# EAGLE schematic SparkFun_Auto_pHAT (EAGLE 9.5.2)

## Sheet 1 of 3
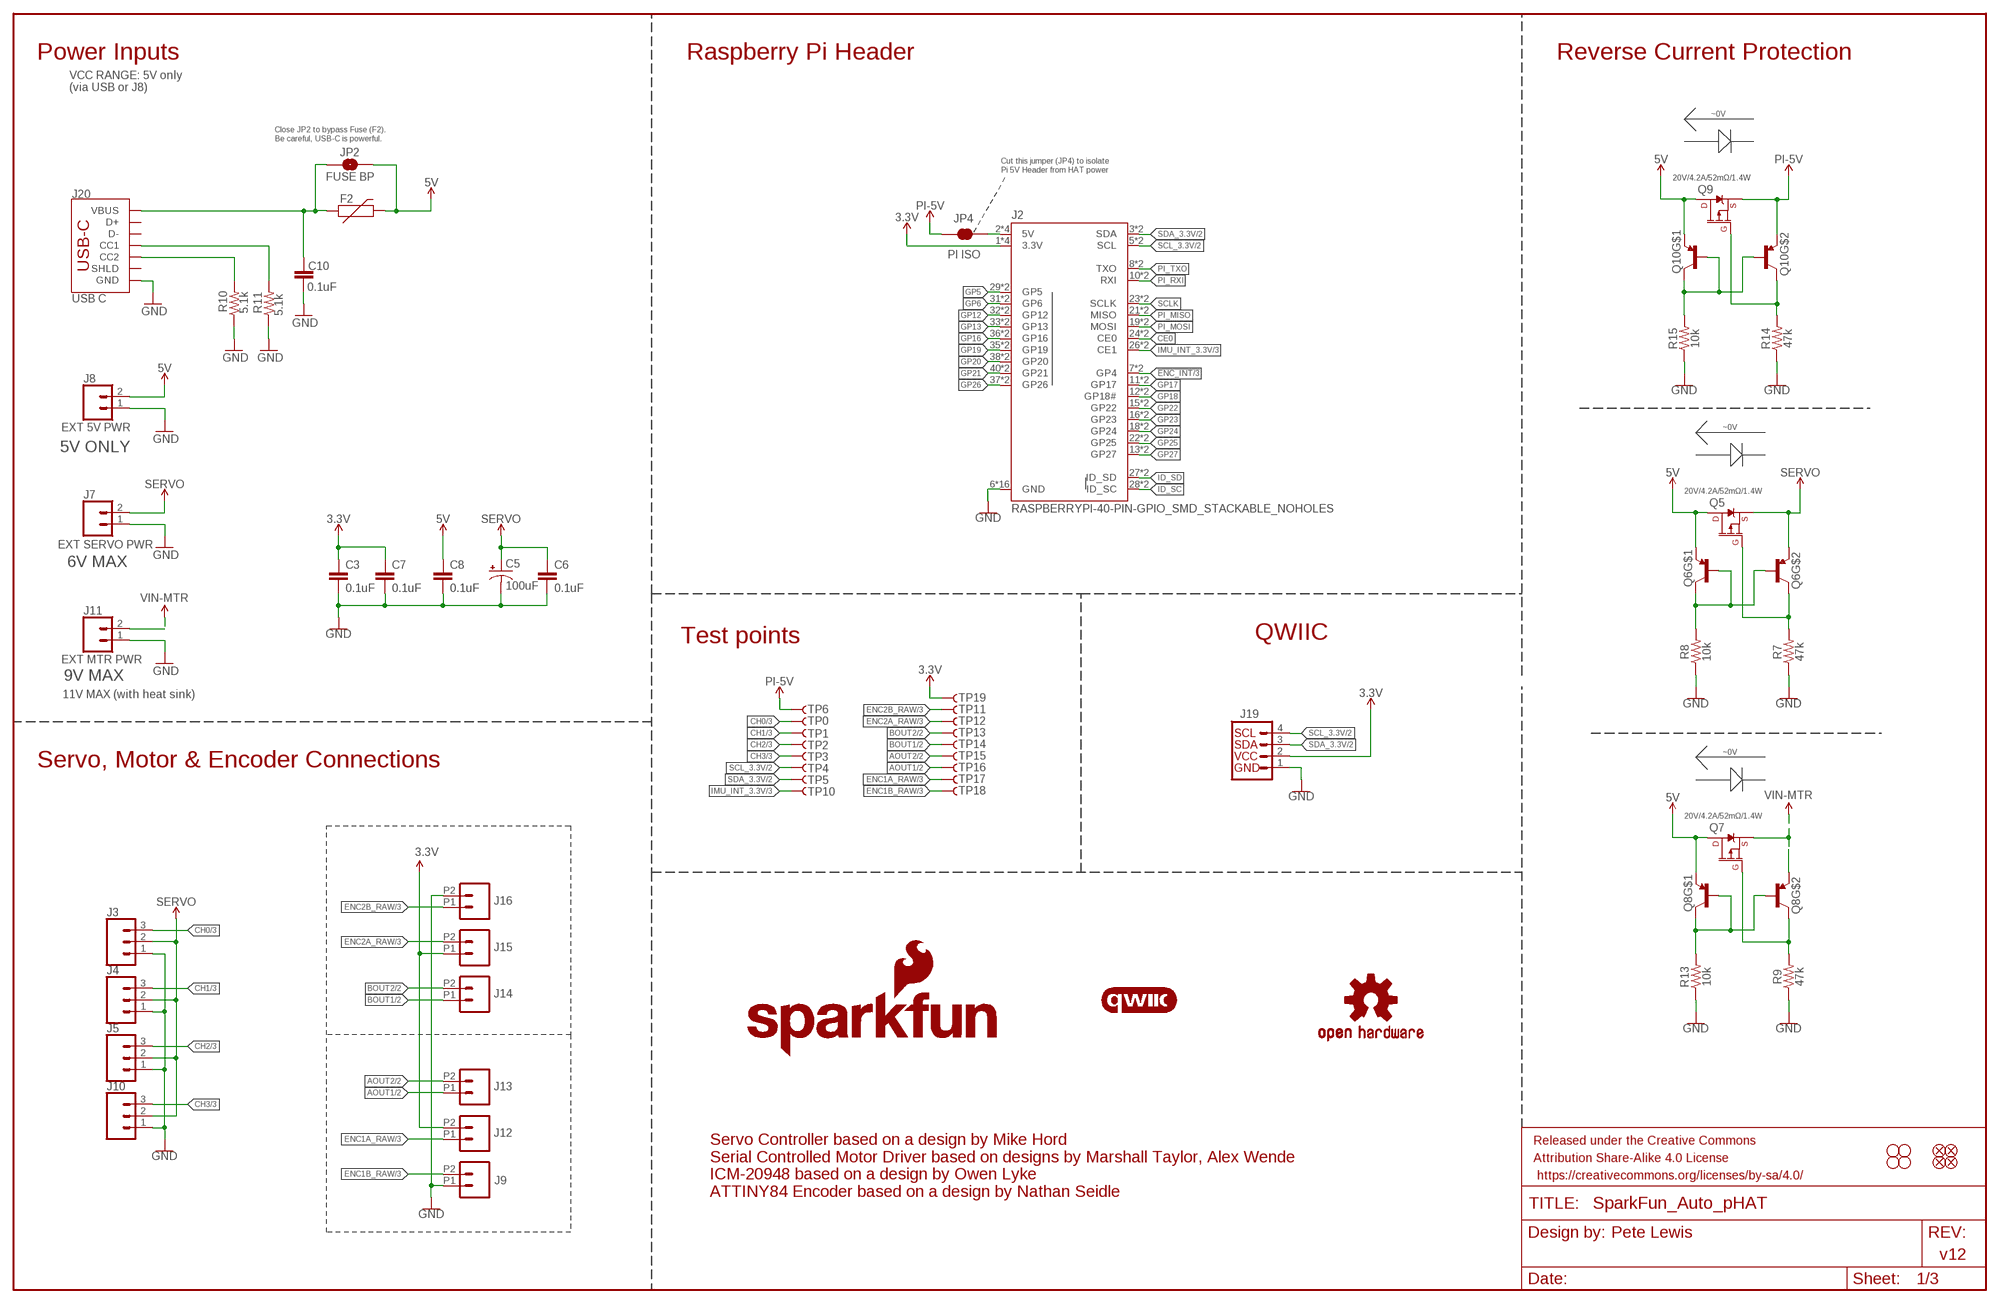
[diagram p0: schematic, sheet 1]

### Parts
C3  0.1uF  0.1UF-0603-25V-(+80/-20%)  [0603]
C5  100uF  100UF-POLAR-25V-20%(ELEC)  [PANASONIC_D]
C6  0.1uF  0.1UF-0603-25V-(+80/-20%)  [0603]
C7  0.1uF  0.1UF-0603-25V-(+80/-20%)  [0603]
C8  0.1uF  0.1UF-0603-25V-(+80/-20%)  [0603]
C10  0.1uF  0.1UF-0603-25V-(+80/-20%)  [0603]
F2  16V/2.5A(5A TRIP)  PPTC_16V_2.5A  [1812]
FD5  FIDUCIALUFIDUCIAL  [FIDUCIAL-MICRO]
FD6  FIDUCIALUFIDUCIAL  [FIDUCIAL-MICRO]
FD7  FIDUCIALUFIDUCIAL  [FIDUCIAL-MICRO]
FD8  FIDUCIALUFIDUCIAL  [FIDUCIAL-MICRO]
FRAME2  FRAME-LEDGER  [CREATIVE_COMMONS]
H9  STAND-OFFTIGHT  [STAND-OFF-TIGHT]
H10  STAND-OFFTIGHT  [STAND-OFF-TIGHT]
H11  STAND-OFFTIGHT  [STAND-OFF-TIGHT]
H12  STAND-OFFTIGHT  [STAND-OFF-TIGHT]
J2  RASPBERRYPI-40-PIN-GPIO_SMD_STACKABLE_NOHOLES  [RASPBERRY_PI_HAT_40_PIN_SMD_STACKABLE_NOHOLES]
J3  CONN_03LOCK  [1X03_LOCK]
J4  CONN_03LOCK  [1X03_LOCK]
J5  CONN_03LOCK  [1X03_LOCK]
J7  EXT SERVO PWR  CONN_02  [1X02]
J8  EXT 5V PWR  CONN_02  [1X02]
J9  CONN_02LG_DRILL  [1X02_2.54_SCREWTERM_LG_DRILL]
J10  CONN_03LOCK  [1X03_LOCK]
J11  EXT MTR PWR  CONN_02  [1X02]
J12  CONN_022.54MM_SCREWTERM  [1X02_2.54_SCREWTERM]
J13  CONN_02LG_DRILL  [1X02_2.54_SCREWTERM_LG_DRILL]
J14  CONN_02LG_DRILL  [1X02_2.54_SCREWTERM_LG_DRILL]
J15  CONN_022.54MM_SCREWTERM  [1X02_2.54_SCREWTERM]
J16  CONN_02LG_DRILL  [1X02_2.54_SCREWTERM_LG_DRILL]
J19  QWIIC_CONNECTORJS-1MM  [JST04_1MM_RA]
J20  USB C  USB_C2-LAYER  [USB-C-16P]
JP2  FUSE BP  JUMPER-SMT_2_NO_SILK  [SMT-JUMPER_2_NO_SILK]
JP4  PI ISO  JUMPER-SMT_2_NC_TRACE_SILK  [SMT-JUMPER_2_NC_TRACE_SILK]
LOGO1  SFE_LOGO_NAME_FLAME.1_INCH  [SFE_LOGO_NAME_FLAME_.1]
LOGO2  OSHW-LOGOS  [OSHW-LOGO-S]
Q5  20V/4.2A/52mΩ/1.4W  MOSFET_PCH-DMG2305UX-7  [SOT23-3]
Q6  TRANS_PNP_DUALSOT-363  [SOT363_PHILIPS]
Q7  20V/4.2A/52mΩ/1.4W  MOSFET_PCH-DMG2305UX-7  [SOT23-3]
Q8  TRANS_PNP_DUALSOT-363  [SOT363_PHILIPS]
Q9  20V/4.2A/52mΩ/1.4W  MOSFET_PCH-DMG2305UX-7  [SOT23-3]
Q10  TRANS_PNP_DUALSOT-363  [SOT363_PHILIPS]
R7  47k  47KOHM-0603-1/10W-1%  [0603@1]
R8  10k  10KOHM-0603-1/10W-1%  [0603@1]
R9  47k  47KOHM-0603-1/10W-1%  [0603@1]
R10  5.1k  5.1KOHM5.1KOHM-0603-1/10W-1%  [0603@1]
R11  5.1k  5.1KOHM5.1KOHM-0603-1/10W-1%  [0603@1]
R13  10k  10KOHM-0603-1/10W-1%  [0603@1]
R14  47k  47KOHM-0603-1/10W-1%  [0603@1]
R15  10k  10KOHM-0603-1/10W-1%  [0603@1]
TP0  TEST-POINT3X4  [PAD.03X.04]
TP1  TEST-POINT3X4  [PAD.03X.04]
TP2  TEST-POINT3X4  [PAD.03X.04]
TP3  TEST-POINT3X4  [PAD.03X.04]
TP4  TEST-POINTTP_15TH_THRU  [TP_15TH]
TP5  TEST-POINTTP_15TH_THRU  [TP_15TH]
TP6  TEST-POINT3X4  [PAD.03X.04]
TP10  TEST-POINT3X4  [PAD.03X.04]
TP11  TEST-POINT3X4  [PAD.03X.04]
TP12  TEST-POINT3X4  [PAD.03X.04]
TP13  TEST-POINT3X4  [PAD.03X.04]
TP14  TEST-POINT3X4  [PAD.03X.04]
TP15  TEST-POINT3X4  [PAD.03X.04]
TP16  TEST-POINT3X4  [PAD.03X.04]
TP17  TEST-POINT3X4  [PAD.03X.04]
TP18  TEST-POINT3X4  [PAD.03X.04]
TP19  TEST-POINTTP_15TH_THRU  [TP_15TH]
U$1  QWIIC_LOGO_5MM  [QWIIC_5MM]

### Nets
3.3V: C3.1 C7.1 J2.1(3.3V) J2.1B(3.3V) J2.17(3.3V) J2.17B(3.3V) J12.P2 J15.P1 J19.2 TP19.P$1 ; also sheet 2,3
5V: C8.1 F2.2 J8.2 JP2.2 Q5.3(D) Q6.1(E) Q7.3(D) Q8.1(E) Q9.3(D) Q10.1(E) ; also sheet 3
!ENC_INT: J2.7(GP4) J2.7B(GP4) ; also sheet 3
AOUT1: J13.P1 TP16.P$1 ; also sheet 2
AOUT2: J13.P2 TP15.P$1 ; also sheet 2
BOUT1: J14.P1 TP14.P$1 ; also sheet 2
BOUT2: J14.P2 TP13.P$1 ; also sheet 2
CC1: J20.A5(CC1) R11.2
CC2: J20.B5(CC2) R10.2
CE0: J2.24(CE0) J2.24B(CE0)
CH0: J3.3 TP0.P$1 ; also sheet 3
CH1: J4.3 TP1.P$1 ; also sheet 3
CH2: J5.3 TP2.P$1 ; also sheet 3
CH3: J10.3 TP3.P$1 ; also sheet 3
ENC1A_RAW: J12.P1 TP17.P$1 ; also sheet 3
ENC1B_RAW: J9.P2 TP18.P$1 ; also sheet 3
ENC2A_RAW: J15.P2 TP12.P$1 ; also sheet 3
ENC2B_RAW: J16.P1 TP11.P$1 ; also sheet 3
GND: C3.2 C5.- C6.2 C7.2 C8.2 C10.2 J2.6(GND) J2.6B(GND) J2.9(GND) J2.9B(GND) J2.14(GND) J2.14B(GND) J2.20(GND) J2.20B(GND) J2.25(GND) J2.25B(GND) J2.30(GND) J2.30B(GND) J2.34(GND) J2.34B(GND) J2.39(GND) J2.39B(GND) J3.1 J4.1 J5.1 J7.1 J8.1 J9.P1 J10.1 J11.1 J16.P2 J19.1 J20.GND J20.GND2(GND) R7.1 R8.1 R9.1 R10.1 R11.1 R13.1 R14.1 R15.1 ; also sheet 2,3
GP5: J2.29(GP5) J2.29B(GP5)
GP6: J2.31(GP6) J2.31B(GP6)
GP12: J2.32(GP12) J2.32B(GP12)
GP13: J2.33(GP13) J2.33B(GP13)
GP16: J2.36(GP16) J2.36B(GP16)
GP17: J2.11(GP17) J2.11B(GP17)
GP18: J2.12(GP18#) J2.12B(GP18#)
GP19: J2.35(GP19) J2.35B(GP19)
GP20: J2.38(GP20) J2.38B(GP20)
GP21: J2.40(GP21) J2.40B(GP21)
GP22: J2.15(GP22) J2.15B(GP22)
GP23: J2.16(GP23) J2.16B(GP23)
GP24: J2.18(GP24) J2.18B(GP24)
GP25: J2.22(GP25) J2.22B(GP25)
GP26: J2.37(GP26) J2.37B(GP26)
GP27: J2.13(GP27) J2.13B(GP27)
ID_SC: J2.28(ID_SC) J2.28B(ID_SC)
ID_SD: J2.27(ID_SD) J2.27B(ID_SD)
IMU_INT_3.3V: J2.26(CE1) J2.26B(CE1) TP10.P$1 ; also sheet 3
N$1: Q5.1(G) Q6.3(C) R7.2
N$11: Q6.2(B) Q6.5(B) Q6.6(C) R8.2
N$15: Q7.1(G) Q8.3(C) R9.2
N$16: Q8.2(B) Q8.5(B) Q8.6(C) R13.2
N$18: Q9.1(G) Q10.3(C) R14.2
N$19: Q10.2(B) Q10.5(B) Q10.6(C) R15.2
N$20: J2.2(5V) J2.2B(5V) J2.4(5V) J2.4B(5V) JP4.2
PI-5V: JP4.1 Q9.2(S) Q10.4(E) TP6.P$1
PI_MISO: J2.21(MISO) J2.21B(MISO)
PI_MOSI: J2.19(MOSI) J2.19B(MOSI)
PI_RXI: J2.10(RXI) J2.10B(RXI)
PI_TXO: J2.8(TXO) J2.8B(TXO)
SCL_3.3V: J2.5(SCL) J2.5B(SCL) J19.4 TP4.P$1 ; also sheet 2,3
SCLK: J2.23(SCLK) J2.23B(SCLK)
SDA_3.3V: J2.3(SDA) J2.3B(SDA) J19.3 TP5.P$1 ; also sheet 2,3
SERVO: C5.+ C6.1 J3.2 J4.2 J5.2 J7.2 J10.2 Q5.2(S) Q6.4(E)
VBUS [power]: C10.1 F2.1 J20.VBUS1(VBUS) J20.VBUS2(VBUS) JP2.1
VIN-MTR: J11.2 Q7.2(S) Q8.4(E) ; also sheet 2
Unconnected: J20.A6(D+) J20.A7(D-) J20.B6(D+) J20.B7(D-) J20.SHLD1(SHLD) J20.SHLD2(SHLD) J20.SHLD3(SHLD) J20.SHLD4(SHLD) J20.SHLD5(SHLD) J20.SHLD6(SHLD) J20.SHLD7(SHLD) J20.SHLD8(SHLD)

### Notes on the sheet
- Power Inputs | Raspberry Pi Header | Reverse Current Protection
- VCC RANGE: 5V only
  (via USB or J8)
- ~0V
- Close JP2 to bypass Fuse (F2).
  Be careful, USB-C is powerful.
- Cut this jumper (JP4) to isolate
  Pi 5V Header from HAT power
- ~0V
- 5V ONLY
- 6V MAX
- Test points | QWIIC
- 9V MAX
- 11V MAX (with heat sink)
- ~0V
- Servo, Motor & Encoder Connections
- Servo Controller based on a design by Mike Hord
  Serial Controlled Motor Driver based on designs by Marshall Taylor, Alex Wende
  ICM-20948 based on a design by Owen Lyke
  ATTINY84 Encoder based on a design by Nathan Seidle
- Pete Lewis
- v12

## Sheet 2 of 3
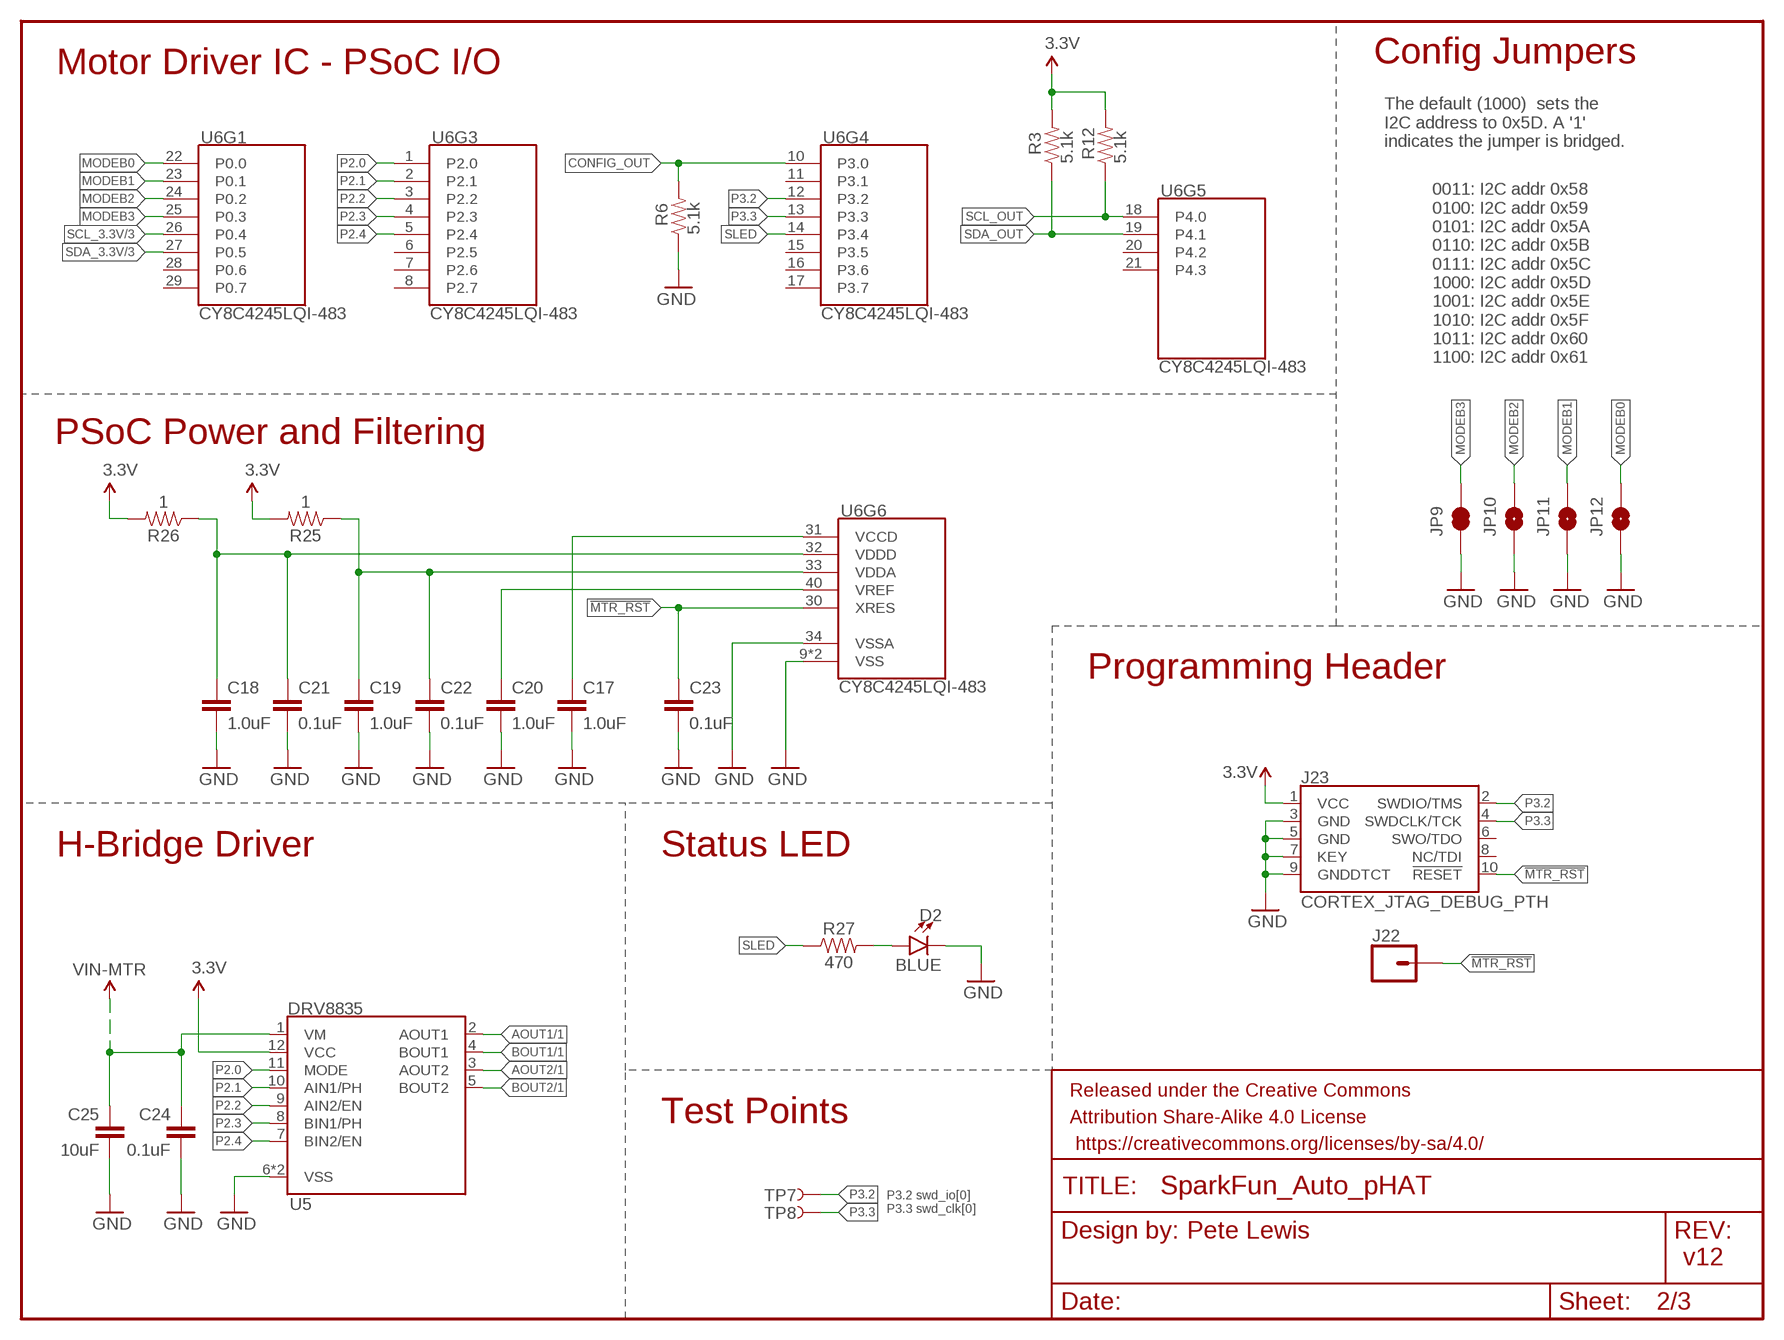
[diagram p1: schematic, sheet 2]

### Parts
C17  1.0uF  1.0UF-0402-16V-10%  [0402]
C18  1.0uF  1.0UF-0402-16V-10%  [0402]
C19  1.0uF  1.0UF-0402-16V-10%  [0402]
C20  1.0uF  1.0UF-0402-16V-10%  [0402]
C21  0.1uF  0.1UF-0402-16V-10%  [0402]
C22  0.1uF  0.1UF-0402-16V-10%  [0402]
C23  0.1uF  0.1UF-0402-16V-10%  [0402]
C24  0.1uF  0.1UF-0402-16V-10%  [0402]
C25  10uF  10UF-0805-25V-10%  [0805]
D2  BLUE  LED-BLUE0603  [LED-0603@1]
FRAME1  FRAME-LETTERNO_PACKAGE  [DUMMY]
J22  CONN_01PTH_NO_SILK_YES_STOP  [1X01_NO_SILK]
J23  CORTEX_JTAG_DEBUG_PTH  [2X5-PTH-1.27MM]
JP9  JUMPER-PAD-2  JUMPER-SMT_2_NC_TRACE_NO-SILK  [SMT-JUMPER_2_NC_TRACE_NO-SILK]
JP10  JUMPER-PAD-2  JUMPER-SMT_2_NO_NO-SILK  [SMT-JUMPER_2_NO_NO-SILK]
JP11  JUMPER-PAD-2  JUMPER-SMT_2_NO_NO-SILK  [SMT-JUMPER_2_NO_NO-SILK]
JP12  JUMPER-PAD-2  JUMPER-SMT_2_NO_NO-SILK  [SMT-JUMPER_2_NO_NO-SILK]
R3  5.1k  5.1KOHM5.1KOHM-0603-1/10W-1%  [0603@1]
R6  5.1k  5.1KOHM5.1KOHM-0603-1/10W-1%  [0603@1]
R12  5.1k  5.1KOHM5.1KOHM-0603-1/10W-1%  [0603@1]
R25  1  1OHM-0603-1/10W-1%  [0603@1]
R26  1  1OHM-0603-1/10W-1%  [0603@1]
R27  470  470OHM-0603-1/10W-1%  [0603@1]
TP7  TEST-POINT3X4  [PAD.03X.04]
TP8  TEST-POINT3X4  [PAD.03X.04]
U5  DRV8835  DRV883X  [WSON-12]
U6  CY8C4245LQI-483  PSOC4_4200_40QFN  [QFN-40]

### Nets
3.3V: J23.1(VCC) R3.2 R12.2 R25.2 R26.2 U5.12(VCC) ; also sheet 1,3
!MTR_RST: C23.1 J22.1 J23.10(!RESET) U6.30(XRES)
AOUT1: U5.2(AOUT1) ; also sheet 1
AOUT2: U5.3(AOUT2) ; also sheet 1
BOUT1: U5.4(BOUT1) ; also sheet 1
BOUT2: U5.5(BOUT2) ; also sheet 1
CONFIG_OUT: R6.2 U6.10(P3.0)
GND: C17.2 C18.2 C19.2 C20.2 C21.2 C22.2 C23.2 C24.2 C25.2 D2.C J23.3(GND) J23.5(GND) J23.7(KEY) J23.9(GNDDTCT) JP9.1 JP10.1 JP11.1 JP12.1 R6.1 U5.6(VSS) U5.PAD(VSS) U6.9(VSS) U6.34(VSSA) U6.EP(VSS) ; also sheet 1,3
MODEB0: JP12.2 U6.22(P0.0)
MODEB1: JP11.2 U6.23(P0.1)
MODEB2: JP10.2 U6.24(P0.2)
MODEB3: JP9.2 U6.25(P0.3)
N$24: C17.1 U6.31(VCCD)
N$25: C19.1 C22.1 R25.1 U6.33(VDDA)
N$26: C20.1 U6.40(VREF)
N$27: D2.A R27.2
P2.0: U5.11(MODE) U6.1(P2.0)
P2.1: U5.10(AIN1/PH) U6.2(P2.1)
P2.2: U5.9(AIN2/EN) U6.3(P2.2)
P2.3: U5.8(BIN1/PH) U6.4(P2.3)
P2.4: U5.7(BIN2/EN) U6.5(P2.4)
P3.2: J23.2(SWDIO/TMS) TP7.P$1 U6.12(P3.2)
P3.3: J23.4(SWDCLK/TCK) TP8.P$1 U6.13(P3.3)
SCL_3.3V: U6.26(P0.4) ; also sheet 1,3
SCL_OUT: R12.1 U6.18(P4.0)
SDA_3.3V: U6.27(P0.5) ; also sheet 1,3
SDA_OUT: R3.1 U6.19(P4.1)
SLED: R27.1 U6.14(P3.4)
VDDD1: C18.1 C21.1 R26.1 U6.32(VDDD)
VIN-MTR: C24.1 C25.1 U5.1(VM) ; also sheet 1
Unconnected: J23.6(SWO/TDO) J23.8(NC/TDI) U6.6(P2.5) U6.7(P2.6) U6.8(P2.7) U6.11(P3.1) U6.15(P3.5) U6.16(P3.6) U6.17(P3.7) U6.20(P4.2) U6.21(P4.3) U6.28(P0.6) U6.29(P0.7) U6.35(P1.0) U6.36(P1.1) U6.37(P1.2) U6.38(P1.3) U6.39(P1.4)

### Notes on the sheet
- Config Jumpers
- Motor Driver IC - PSoC I/O
- The default (1000)  sets the 
  I2C address to 0x5D. A '1' 
  indicates the jumper is bridged.
- 0011: I2C addr 0x58
  0100: I2C addr 0x59
  0101: I2C addr 0x5A
  0110: I2C addr 0x5B
  0111: I2C addr 0x5C
  1000: I2C addr 0x5D
  1001: I2C addr 0x5E
  1010: I2C addr 0x5F
  1011: I2C addr 0x60
  1100: I2C addr 0x61
- PSoC Power and Filtering
- Programming Header
- H-Bridge Driver | Status LED
- Test Points
- P3.2 swd_io[0]
  P3.3 swd_clk[0]
- Pete Lewis
- v12

## Sheet 3 of 3
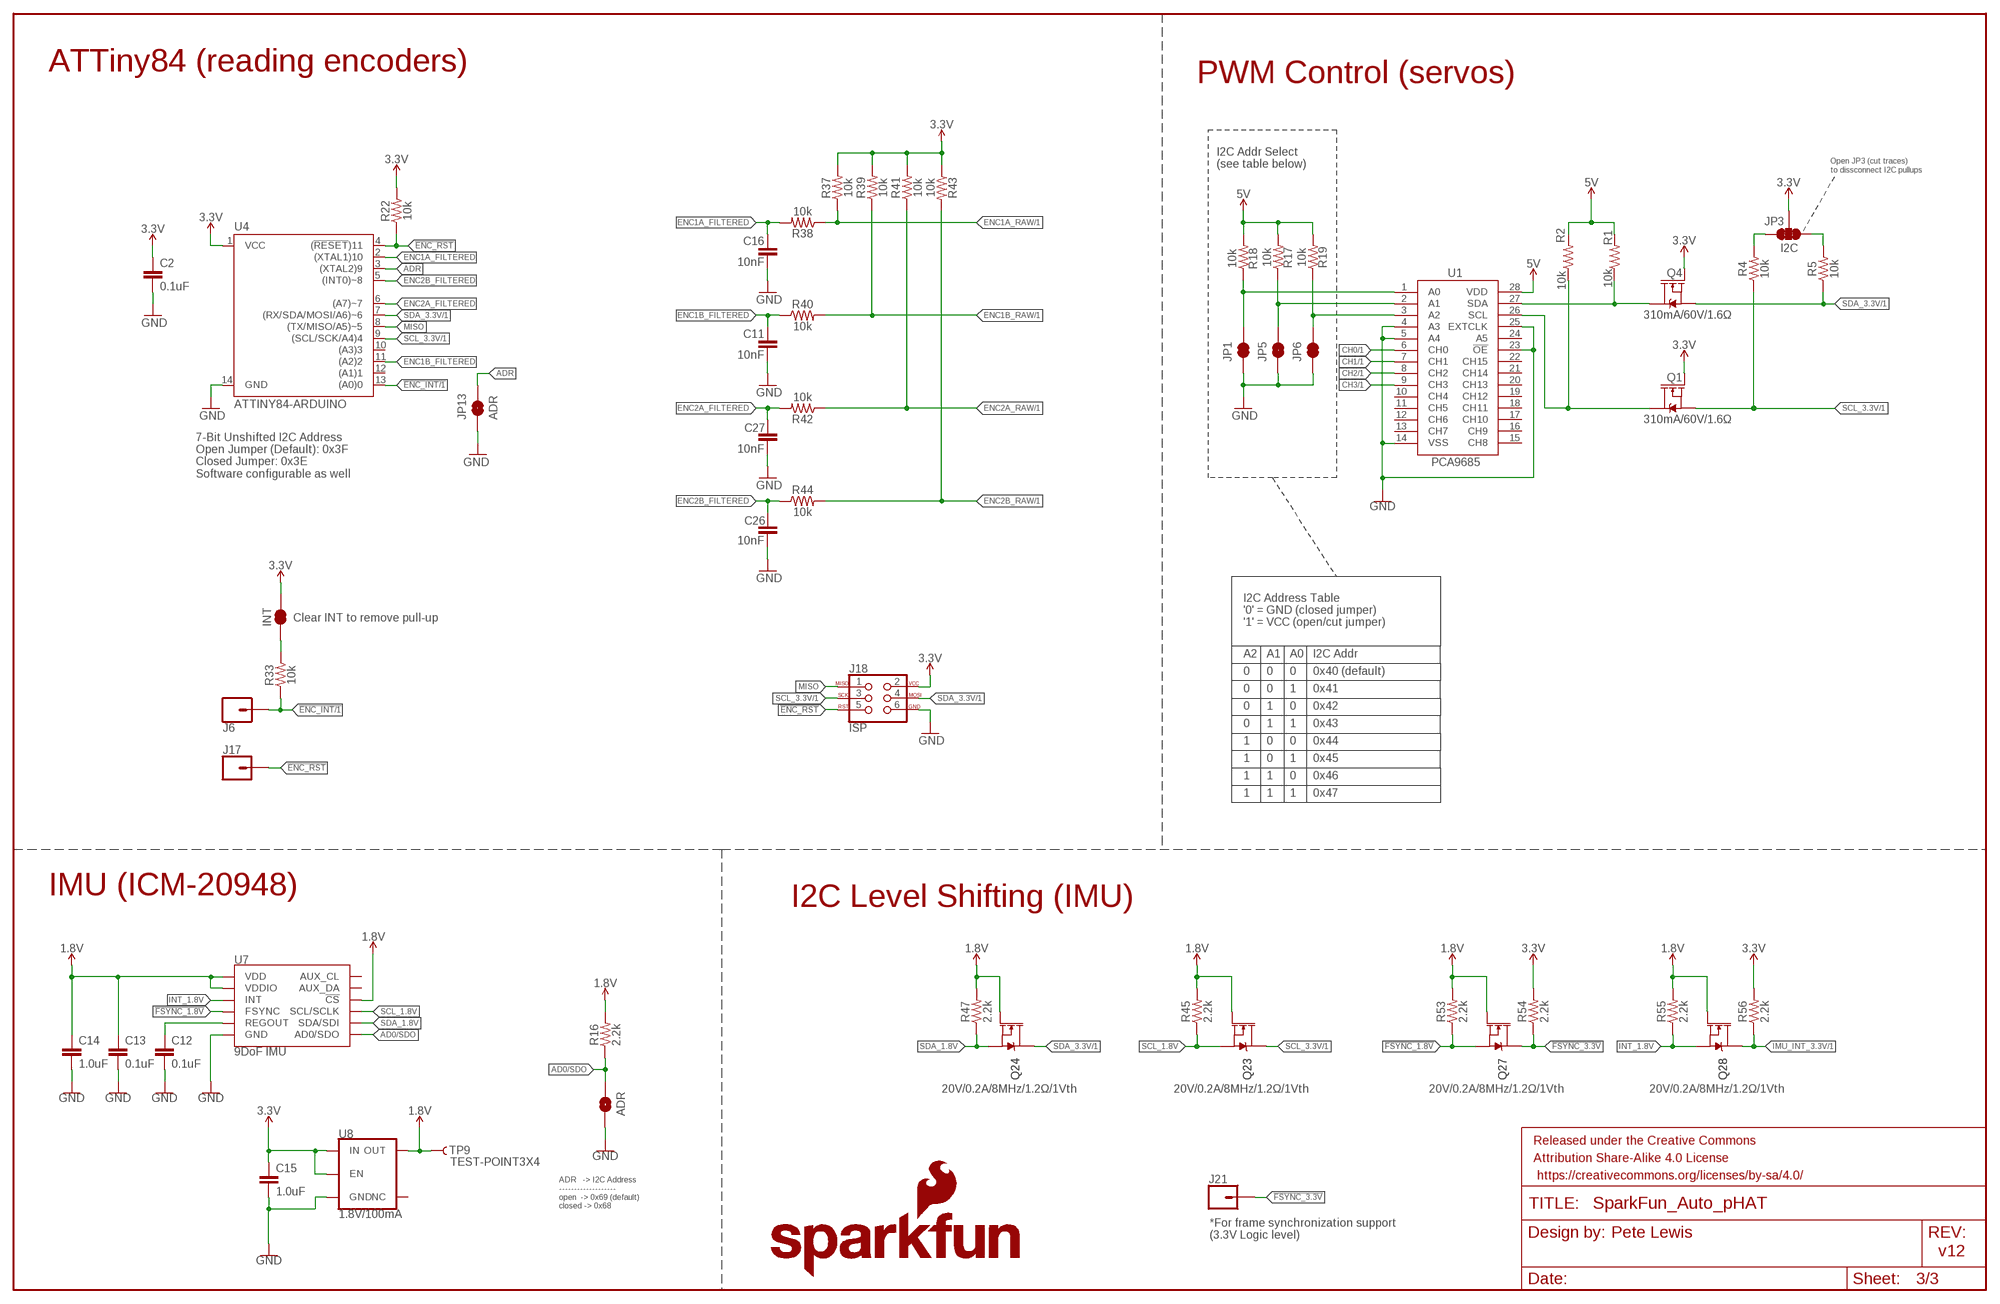
[diagram p2: schematic, sheet 3]

### Parts
C2  0.1uF  0.1UF-0603-25V-(+80/-20%)  [0603]
C11  10nF  10NF-0603-50V-10%  [0603]
C12  0.1uF  0.1UF-0603-25V-5%  [0603]
C13  0.1uF  0.1UF-0603-25V-5%  [0603]
C14  1.0uF  1.0UF-0603-16V-10%-X7R  [0603]
C15  1.0uF  1.0UF-0603-16V-10%-X7R  [0603]
C16  10nF  10NF-0603-50V-10%  [0603]
C26  10nF  10NF-0603-50V-10%  [0603]
C27  10nF  10NF-0603-50V-10%  [0603]
FRAME3  FRAME-LEDGER  [CREATIVE_COMMONS]
INT  JUMPER-SMT_2_NC_TRACE_SILK  [SMT-JUMPER_2_NC_TRACE_SILK]
J6  CONN_01PTH_NO_SILK_YES_STOP  [1X01_NO_SILK]
J17  CONN_01PTH_NO_SILK_YES_STOP  [1X01_NO_SILK]
J18  ISP  AVR_SPI_PROG_3X2TESTPOINTS  [2X3_TEST_POINTS]
J21  CONN_01PTH_NO_SILK_YES_STOP  [1X01_NO_SILK]
JP1  JUMPER-PAD-2  JUMPER-SMT_2_NC_TRACE_NO-SILK  [SMT-JUMPER_2_NC_TRACE_NO-SILK]
JP3  I2C  JUMPER-SMT_3_2-NC_TRACE_SILK  [SMT-JUMPER_3_2-NC_TRACE_SILK]
JP5  JUMPER-PAD-2  JUMPER-SMT_2_NC_TRACE_NO-SILK  [SMT-JUMPER_2_NC_TRACE_NO-SILK]
JP6  JUMPER-PAD-2  JUMPER-SMT_2_NC_TRACE_NO-SILK  [SMT-JUMPER_2_NC_TRACE_NO-SILK]
JP13  ADR  JUMPER-SMT_2_NO_SILK  [SMT-JUMPER_2_NO_SILK]
JP15  ADR  JUMPER-SMT_2_NO_SILK  [SMT-JUMPER_2_NO_SILK]
LOGO4  SFE_LOGO_NAME_FLAME.1_INCH  [SFE_LOGO_NAME_FLAME_.1]
Q1  310mA/60V/1.6Ω  MOSFET-NCH-2N7002PW  [SOT323]
Q4  310mA/60V/1.6Ω  MOSFET-NCH-2N7002PW  [SOT323]
Q23  20V/0.2A/8MHz/1.2Ω/1Vth  MOSFET-NCH-RE1C00UNTL  [SOT-416FL]
Q24  20V/0.2A/8MHz/1.2Ω/1Vth  MOSFET-NCH-RE1C00UNTL  [SOT-416FL]
Q27  20V/0.2A/8MHz/1.2Ω/1Vth  MOSFET-NCH-RE1C00UNTL  [SOT-416FL]
Q28  20V/0.2A/8MHz/1.2Ω/1Vth  MOSFET-NCH-RE1C00UNTL  [SOT-416FL]
R1  10k  10KOHM-0603-1/10W-1%  [0603@1]
R2  10k  10KOHM-0603-1/10W-1%  [0603@1]
R4  10k  10KOHM-0603-1/10W-1%  [0603@1]
R5  10k  10KOHM-0603-1/10W-1%  [0603@1]
R16  2.2k  2.2KOHM-0402T-1/16W-1%  [0402-TIGHT]
R17  10k  10KOHM-0603-1/10W-1%  [0603@1]
R18  10k  10KOHM-0603-1/10W-1%  [0603@1]
R19  10k  10KOHM-0603-1/10W-1%  [0603@1]
R22  10k  10KOHM-0603-1/10W-1%  [0603@1]
R33  10k  10KOHM-0603-1/10W-1%  [0603@1]
R37  10k  10KOHM-0603-1/10W-1%  [0603@1]
R38  10k  10KOHM-0603-1/10W-1%  [0603@1]
R39  10k  10KOHM-0603-1/10W-1%  [0603@1]
R40  10k  10KOHM-0603-1/10W-1%  [0603@1]
R41  10k  10KOHM-0603-1/10W-1%  [0603@1]
R42  10k  10KOHM-0603-1/10W-1%  [0603@1]
R43  10k  10KOHM-0603-1/10W-1%  [0603@1]
R44  10k  10KOHM-0603-1/10W-1%  [0603@1]
R45  2.2k  2.2KOHM-0402T-1/16W-1%  [0402-TIGHT]
R47  2.2k  2.2KOHM-0402T-1/16W-1%  [0402-TIGHT]
R53  2.2k  2.2KOHM-0402T-1/16W-1%  [0402-TIGHT]
R54  2.2k  2.2KOHM-0402T-1/16W-1%  [0402-TIGHT]
R55  2.2k  2.2KOHM-0402T-1/16W-1%  [0402-TIGHT]
R56  2.2k  2.2KOHM-0402T-1/16W-1%  [0402-TIGHT]
TP9  TEST-POINT3X4  [PAD.03X.04]
U1  PCA9685  [TSSOP-28_4MM]
U4  ATTINY84-ARDUINO  [SO14]
U7  9DoF IMU  ICM-20948  [QFN24-3X3]
U8  1.8V/100mA  V_REG_SP6214-1.8V  [SC70]

### Nets
1.8V: C13.1 C14.1 Q23.1(G) Q24.1(G) Q27.1(G) Q28.1(G) R16.2 R45.2 R47.2 R53.2 R55.2 TP9.P$1 U7.8(VDDIO) U7.13(VDD) U7.22(!CS) U8.5(OUT)
3.3V: C2.1 C15.1 INT.2 J18.2 JP3.2 Q1.1(G) Q4.1(G) R22.2 R37.2 R39.2 R41.2 R43.1 R54.2 R56.2 U4.1(VCC) U8.1(IN) U8.3(EN) ; also sheet 1,2
5V: R1.2 R2.2 R17.2 R18.2 R19.2 U1.28(VDD) ; also sheet 1
!ENC_INT: J6.1 R33.1 U4.13((A0)0) ; also sheet 1
!ENC_RST: J17.1 J18.5 R22.1 U4.4((!RESET!)11)
!FSYNC_1.8V: Q27.2(S) R53.1 U7.11(FSYNC)
!FSYNC_3.3V: J21.1 Q27.3(D) R54.1
AD0/SDO: JP15.2 R16.1 U7.9(AD0/SDO)
ADD_A0: JP1.2 R18.1 U1.1(A0)
ADD_A1: JP5.2 R17.1 U1.2(A1)
ADD_A2: JP6.2 R19.1 U1.3(A2)
ADR: JP13.2 U4.3((XTAL2)9)
CH0: U1.6(CH0) ; also sheet 1
CH1: U1.7(CH1) ; also sheet 1
CH2: U1.8(CH2) ; also sheet 1
CH3: U1.9(CH3) ; also sheet 1
ENC1A_FILTERED: C16.1 R38.2 U4.2((XTAL1)10)
ENC1A_RAW: R37.1 R38.1 ; also sheet 1
ENC1B_FILTERED: C11.1 R40.1 U4.11((A2)2)
ENC1B_RAW: R39.1 R40.2 ; also sheet 1
ENC2A_FILTERED: C27.1 R42.2 U4.6((A7)~7)
ENC2A_RAW: R41.1 R42.1 ; also sheet 1
ENC2B_FILTERED: C26.1 R44.1 U4.5((INT0)~8)
ENC2B_RAW: R43.2 R44.2 ; also sheet 1
GND: C2.2 C11.2 C12.2 C13.2 C14.2 C15.2 C16.2 C26.2 C27.2 J18.6 JP1.1 JP5.1 JP6.1 JP13.1 JP15.1 U1.4(A3) U1.5(A4) U1.14(VSS) U1.23(!OE) U1.25(EXTCLK) U4.14(GND) U7.18(GND) U7.20(GND) U8.2(GND) ; also sheet 1,2
IMU_INT_3.3V: Q28.3(D) R56.1 ; also sheet 1
INT_1.8V: Q28.2(S) R55.1 U7.12(INT)
INT_R: INT.1 R33.2
MISO: J18.1 U4.8((TX/MISO/A5)~5)
N$2: JP3.3 R4.2
N$3: Q1.3(D) R2.1 U1.26(SCL)
N$4: Q4.3(D) R1.1 U1.27(SDA)
N$5: JP3.1 R5.2
N$29: C12.1 U7.10(REGOUT)
SCL_1.8V: Q23.2(S) R45.1 U7.23(SCL/SCLK)
SCL_3.3V: J18.3 Q1.2(S) Q23.3(D) R4.1 U4.9((SCL/SCK/A4)4) ; also sheet 1,2
SDA_1.8V: Q24.2(S) R47.1 U7.24(SDA/SDI)
SDA_3.3V: J18.4 Q4.2(S) Q24.3(D) R5.1 U4.7((RX/SDA/MOSI/A6)~6) ; also sheet 1,2
Unconnected: U1.10(CH4) U1.11(CH5) U1.12(CH6) U1.13(CH7) U1.15(CH8) U1.16(CH9) U1.17(CH10) U1.18(CH11) U1.19(CH12) U1.20(CH13) U1.21(CH14) U1.22(CH15) U1.24(A5) U4.10((A3)3) U4.12((A1)1) U7.7(AUX_CL) U7.21(AUX_DA) U8.4(NC)

### Notes on the sheet
- ATTiny84 (reading encoders)
- PWM Control (servos)
- I2C Addr Select
  (see table below)
- Open JP3 (cut traces)
  to dissconnect I2C pullups
- 7-Bit Unshifted I2C Address
  Open Jumper (Default): 0x3F
  Closed Jumper: 0x3E
  Software configurable as well
- Clear INT to remove pull-up
- I2C Address Table
  '0' = GND (closed jumper)
  '1' = VCC (open/cut jumper)
- A2 | A1 | A0 | I2C Addr
- 0 | 0 | 0 | 0x40 (default)
- 0 | 0 | 1 | 0x41
- 0 | 1 | 0 | 0x42
- 0 | 1 | 1 | 0x43
- 1 | 0 | 0 | 0x44
- 1 | 0 | 1 | 0x45
- 1 | 1 | 0 | 0x46
- 1 | 1 | 1 | 0x47
- IMU (ICM-20948)
- I2C Level Shifting (IMU)
- ADR   -> I2C Address
  -------------------
  open  -> 0x69 (default)
  closed -> 0x68
- Pete Lewis
- *For frame synchronization support
  (3.3V Logic level)
- v12

## Library data of the parts
C2 C3 C6-C8 C10 = SparkFun-Capacitors:0.1UF: 0.1µF ceramic capacitors A capacitor is a passive two-terminal electrical component used to store electrical energy temporarily in an electric field.; PROD_ID: CAP-00810
C5 = SparkFun-Capacitors:100UF-POLAR: 100µF polarized capacitors A capacitor is a passive two-terminal electrical component used to store electrical energy temporarily in an electric field.; PROD_ID: CAP-12547
C11 C16 C26 C27 = SparkFun-Capacitors:10NF: 0.01uF/10nF/10,000pF ceramic capacitors A capacitor is a passive two-terminal electrical component used to store electrical energy temporarily in an electric field. CAP-09321; PROD_ID: CAP-00867
C12 C13 = SparkFun-Capacitors:0.1UF: 0.1µF ceramic capacitors A capacitor is a passive two-terminal electrical component used to store electrical energy temporarily in an electric field.; PROD_ID: CAP-08604
C14 C15 = SparkFun-Capacitors:1.0UF: 1µF ceramic capacitors A capacitor is a passive two-terminal electrical component used to store electrical energy temporarily in an electric field.; PROD_ID: CAP-13930
C17-C20 = SparkFun-Capacitors:1.0UF: 1µF ceramic capacitors A capacitor is a passive two-terminal electrical component used to store electrical energy temporarily in an electric field.; PROD_ID: CAP-12417
C21-C24 = SparkFun-Capacitors:0.1UF: 0.1µF ceramic capacitors A capacitor is a passive two-terminal electrical component used to store electrical energy temporarily in an electric field.; PROD_ID: CAP-12416
C25 = SparkFun-Capacitors:10UF: 10.0µF ceramic capacitors A capacitor is a passive two-terminal electrical component used to store electrical energy temporarily in an electric field.; PROD_ID: CAP-14259
D2 = SparkFun-LED:LED-BLUE: Blue SMD LED Used in manufacturing of various products at SparkFun Packages: 0603 - SMD 0603 package [Product Link] <http://www.digikey.com/product-detail/en/SMLE12BC7TT86/511-1589-2-ND/1641808> 1206 - SMD1206 package [Product Link] <http://www.digikey.com/product-detail/en/lite-on-inc/LTST-C150TBKT/160-1643-1-ND/573584> SparkFun Products: ESP8266 Thing-Dev Board <https://www.sparkfun.com/products/13711> RedBoard <https://www.sparkfun.com/products/12757>; PROD_ID: DIO-08575
F2 = SparkFun-Fuses:PPTC: Resettable Fuse PPTC Resettable Fuse. Really a sort of resistor with a polymeric positive temperature coefficient whose resistance increases dramatically with an increase in temperature. When heated by the power passing through the resistance rises causing the current to be limited, protecting the circuit. This is achieved by the transition of the polymer from a crystalline to an amorphous state where the conductive carbon separates breaking the conductive pathways found in the cool crystalline structure. When a PPTC cools back down it resumes conducting letting the circuit turn back on. SparkFun Products: SparkFun RedBoard - Programmed with Arduino <https://www.sparkfun.com/products/12757> Pro Micro - 5V/16MHz <https://www.sparkfun.com/products/12640> Arduino Pro 328 - 5V/16MHz <https://www.sparkfun.com/products/10915> MP3 Trigger <https://www.sparkfun.com/products/13720>; PROD_ID: RES-14390
FD5-FD8 = SparkFun-Aesthetics:FIDUCIAL: Fiducial Alignment Points Point-of-reference for pick-and-place machines and other optical instruments.
FRAME1 = SparkFun-Aesthetics:FRAME-LETTER: Schematic Frame - Letter Standard 8.5x11 US Letter frame; DESIGNER: Nobody; VERSION: v01
FRAME2 FRAME3 = SparkFun-Aesthetics:FRAME-LEDGER: Schematic Frame - Ledger Standard 11x14 US Ledger frame
H9-H12 = SparkFun-Hardware:STAND-OFF: Stand Off Drill holes for mechanically mounting via screws, standoffs, etc. Note: Use the keepout ring to avoid running the screw head into surrounding components. Variant Overviews STAND-OFF - Mechanical footprint for a #4 phillips button head screw. STAND-OFF-TIGHT - Mechanical footprint for a #4 phillips button head screw, Example SparkFun Products Screw - Phillips Head (1/4", 4-40, 10 pack) <https://www.sparkfun.com/products/10453> (PRT-10453) Screw - Phillips Head (1/2", 4-40, 10 pack) <https://www.sparkfun.com/products/10452> (PRT-10452) Screw - Phillips Head (3/4", 4-40, 10 pack) <https://www.sparkfun.com/products/10451> (PRT-10451) Screw - Phillips Head (1", 4-40, 10 pack) <https://www.sparkfun.com/products/10450> (PRT-10450)
INT JP1 JP4-JP6 JP9 = SparkFun-Jumpers:JUMPER-SMT_2_NC_TRACE: Normally closed trace jumper This jumper has a trace between two pads so it's normally closed (NC). Use a razor knife to open the connection. For best results follow the IPC guidelines for cutting traces: Cutout at least 0.063 mm (0.005 in). Remove all loose material to clean up the cut area. Seal the cut with an approved epoxy. Reapply solder to reclose the connection.
J2 = SparkFun-Connectors:RASPBERRYPI-40-PIN-GPIO: Raspberry Pi GPIO Header 2x20 pin connector, as found on B, B+, A+ models. Both shrouded PTH and SMT versions available. SparkFun Products: GPIO Shrouded Header <https://www.sparkfun.com/products/13054>- PTH SparkFun Pi Wedge (Preassembled) <https://www.sparkfun.com/products/13717>; PROD_ID: CONN-14914; PROD_ID_2: CONN-14915
J3-J5 J10 = SparkFun-Connectors:CONN_03: Multi connection point. Often used as Generic Header-pin footprint for 0.1 inch spaced/style header connections On any of the 0.1 inch spaced packages, you can populate with these: Break Away Headers - Straight <https://www.sparkfun.com/products/116> (PRT-00116) Break Away Male Headers - Right Angle <https://www.sparkfun.com/products/553> (PRT-00553) Female Headers <https://www.sparkfun.com/products/115> (PRT-00115) Break Away Headers - Machine Pin <https://www.sparkfun.com/products/117> (PRT-00117) Break Away Female Headers - Swiss Machine Pin <https://www.sparkfun.com/products/743> (PRT-00743) Stackable Header - 3 Pin (Female, 0.1") <https://www.sparkfun.com/products/13875> (PRT-13875) For SCREWTERMINALS and SPRING TERMINALS visit here: Screw Terimnals on SparkFun.com <https://www.sparkfun.com/search/results?term=Screw+Terminals> (5mm/3.5mm/2.54mm spacing) This device is also useful as a general connection point to wire up your design to another part of your project. Our various solder wires solder well into these plated through hole pads. Hook-Up Wire - Assortment (Stranded, 22 AWG) <https://www.sparkfun.com/products/11375> (PRT-11375) Hook-Up Wire - Assortment (Solid Core, 22 AWG) <https://www.sparkfun.com/products/11367> (PRT-11367) View the entire wire category on our website here <https://www.sparkfun.com/categories/141> Special notes: Molex polarized connector foot print use with SKU : PRT-08232 with associated crimp pins and housings.
J6 J17 J21 J22 = SparkFun-Connectors:CONN_01: Single connection point. Often used as Generic Header-pin footprint for 0.1 inch spaced/style header connections On any of the 0.1 inch spaced packages, you can populate with these: Break Away Headers - Straight <https://www.sparkfun.com/products/116> (PRT-00116) Break Away Male Headers - Right Angle <https://www.sparkfun.com/products/553> (PRT-00553) Female Headers <https://www.sparkfun.com/products/115> (PRT-00115) Break Away Headers - Machine Pin <https://www.sparkfun.com/products/117> (PRT-00117) Break Away Female Headers - Swiss Machine Pin <https://www.sparkfun.com/products/743> (PRT-00743) This device is also useful as a general connection point to wire up your design to another part of your project. Our various solder wires solder well into these plated through hole pads. Hook-Up Wire - Assortment (Stranded, 22 AWG) <https://www.sparkfun.com/products/11375> (PRT-11375) Hook-Up Wire - Assortment (Solid Core, 22 AWG) <https://www.sparkfun.com/products/11367> (PRT-11367) View the entire wire category on our website here <https://www.sparkfun.com/categories/141> Special notes: SMTSO-256-ET is a "flush mount" nut for a 4-40 screw. We mostly use this on specialty testbeds; it is a nice way to connect hardware to your PCB at an adjustable hieght. Also note, the SNAP packages are for using a snappable style connector. We sell a baggie of snaps and they are also used on two LilyPad designs: Snap Assortment - 30 pack (male and female) <https://www.sparkfun.com/products/11347> (DEV-11347) LilyPad Arduino SimpleSnap <https://www.sparkfun.com/products/10941> (DEV-10941) LilyPad SimpleSnap Protoboard <https://www.sparkfun.com/products/10940> (DEV-10940)
J7 J8 J11 J12 J15 = SparkFun-Connectors:CONN_02: Multi connection point. Often used as Generic Header-pin footprint for 0.1 inch spaced/style header connections On any of the 0.1 inch spaced packages, you can populate with these: Break Away Headers - Straight <https://www.sparkfun.com/products/116> (PRT-00116) Break Away Male Headers - Right Angle <https://www.sparkfun.com/products/553> (PRT-00553) Female Headers <https://www.sparkfun.com/products/115> (PRT-00115) Break Away Headers - Machine Pin <https://www.sparkfun.com/products/117> (PRT-00117) Break Away Female Headers - Swiss Machine Pin <https://www.sparkfun.com/products/743> (PRT-00743) For SCREWTERMINALS and SPRING TERMINALS visit here: Screw Terimnals on SparkFun.com <https://www.sparkfun.com/search/results?term=Screw+Terminals> (5mm/3.5mm/2.54mm spacing) This device is also useful as a general connection point to wire up your design to another part of your project. Our various solder wires solder well into these plated through hole pads. Hook-Up Wire - Assortment (Stranded, 22 AWG) <https://www.sparkfun.com/products/11375> (PRT-11375) Hook-Up Wire - Assortment (Solid Core, 22 AWG) <https://www.sparkfun.com/products/11367> (PRT-11367) View the entire wire category on our website here <https://www.sparkfun.com/categories/141> Special notes: Molex polarized connector foot print use with: PRT-08233 with associated crimp pins and housings. 2.54_SCREWTERM for use with PRT-10571. 3.5mm Screw Terminal footprints for PRT-08084 5mm Screw Terminal footprints for use with PRT-08432
J9 J13 J14 J16 = autophat:CONN_02: Multi connection point. Often used as Generic Header-pin footprint for 0.1 inch spaced/style header connections On any of the 0.1 inch spaced packages, you can populate with these: Break Away Headers - Straight <https://www.sparkfun.com/products/116> (PRT-00116) Break Away Male Headers - Right Angle <https://www.sparkfun.com/products/553> (PRT-00553) Female Headers <https://www.sparkfun.com/products/115> (PRT-00115) Break Away Headers - Machine Pin <https://www.sparkfun.com/products/117> (PRT-00117) Break Away Female Headers - Swiss Machine Pin <https://www.sparkfun.com/products/743> (PRT-00743) For SCREWTERMINALS and SPRING TERMINALS visit here: Screw Terimnals on SparkFun.com <https://www.sparkfun.com/search/results?term=Screw+Terminals> (5mm/3.5mm/2.54mm spacing) This device is also useful as a general connection point to wire up your design to another part of your project. Our various solder wires solder well into these plated through hole pads. Hook-Up Wire - Assortment (Stranded, 22 AWG) <https://www.sparkfun.com/products/11375> (PRT-11375) Hook-Up Wire - Assortment (Solid Core, 22 AWG) <https://www.sparkfun.com/products/11367> (PRT-11367) View the entire wire category on our website here <https://www.sparkfun.com/categories/141> Special notes: Molex polarized connector foot print use with: PRT-08233 with associated crimp pins and housings. 2.54_SCREWTERM for use with PRT-10571. 3.5mm Screw Terminal footprints for PRT-08084 5mm Screw Terminal footprints for use with PRT-08432
J18 = SparkFun-Connectors:AVR_SPI_PROG_3X2: AVR ISP 6 Pin This is the reduced ISP connector for AVR programming. Common on Arduino. This footprint will take up less PCB space and can be used with a 10-pin to 6-pin adapter such as SKU: BOB-08508 **Special note about "TEST_POINT" package. The stop mask is on the top side, so if you want your programming test points to be on the bottom of your board, make sure to place this package on the bottom side of the board. This also ensure that the orientation to program from the bottom side will be correct. SparkFun Products: SparkFun ISP Pogo Adapter <https://www.sparkfun.com/products/11591> - NS Tiny AVR Programmer <https://www.sparkfun.com/products/11801> -PTH
J19 = SparkFun-Connectors:QWIIC_CONNECTOR: SparkFun I2C Standard Qwiic Connector An SMD 1mm pitch JST connector makes it easy and quick (get it? Qwiic?) to connect I2C devices to each other. The Qwiic system <http://www.sparkfun.com/qwiic> enables fast and solderless connection between popular platforms and various sensors and actuators. We carry 200mm <https://www.sparkfun.com/products/14204>, 100mm <https://www.sparkfun.com/products/14205>, 50mm <https://www.sparkfun.com/products/14206>, and breadboard friendly <https://www.sparkfun.com/products/14207> Qwiic cables. We also offer 10 pcs strips <https://www.sparkfun.com/products/14323> the SMD connectors.; PROD_ID: CONN-13694; VALUE: QWIIC_RIGHT_ANGLE
J20 = SparkFun-Connectors:USB_C: USB Type C 16Pin Connector Super Speed pins not available on the 16-pin purely SMD connector so this part is best for USB 2.0 implementations. D1 and D2 are tied together enabling D+/- no matter which way the cable is plugged into the connector. The two channel configuration pins (CC1/2) are exposed. These are normally connected to ground via 5.1k resistors but can be reconfigured for high current/high power applications.; PROD_ID: CONN-14122
J23 = SparkFun-Connectors:CORTEX_JTAG_DEBUG: Cortex Debug Connector - 10 pin Supports JTAG debug, Serial Wire debug, and Serial Wire Viewer. PTH and SMD connector options available. General Connector Information <http://infocenter.arm.com/help/topic/com.arm.doc.faqs/attached/13634/cortex_debug_connectors.pdf> Products: PTH Connector <http://www.digikey.com/product-detail/en/cnc-tech/3220-10-0100-00/1175-1627-ND/3883661> -via Digi-Key SparkFun PSoc <https://www.sparkfun.com/products/13229> SparkFun T <https://www.sparkfun.com/products/13810>
JP2 JP10-JP13 JP15 = SparkFun-Jumpers:JUMPER-SMT_2_NO: Normally open jumper This jumper has two pads in close proximity to each other. Apply solder to close the connection. Round pads are easier to solder for beginners, but are a lot larger. SparkFun Product that uses the round pads: SparkFun EL Sequencer <https://www.sparkfun.com/products/12781>
JP3 = SparkFun-Jumpers:JUMPER-SMT_3_2-NC_TRACE: Normally closed trace jumper (2 of 2 connections) This jumper has a trace between all three pads so they are normally closed (NC). Use a razor knife to open the connection(s). For best results follow the IPC guidelines for cutting traces: Cutout at least 0.063 mm (0.005 in). Remove all loose material to clean up the cut area. Seal the cut with an approved epoxy. Reapply solder to reclose the connection(s).
LOGO1 LOGO4 = SparkFun-Aesthetics:SFE_LOGO_NAME_FLAME: SparkFun Font Logo w/ Flame This is the SparkFun full logo. The logo on the schematic will always be the same size; the package variant is the height of the flame part of the logo. Default layer for the logo on the board is tSilk.
LOGO2 = SparkFun-Aesthetics:OSHW-LOGO: Open-Source Hardware (OSHW) Logo This logo indicates the piece of hardware it is found on incorporates a OSHW license and/or adheres to the definition of open source hardware found here: http://freedomdefined.org/OSHW
Q1 Q4 = SparkFun-DiscreteSemi:MOSFET-NCH: N-channel MOSFETs Voltage controlled devices that allow control of high current outputs. SparkFun Products: SparkFun OpenScale <https://www.sparkfun.com/products/13261> SparkFun Digital Sandbox <https://www.sparkfun.com/products/12651> SparkFun Monster Moto Shield <https://www.sparkfun.com/products/10182> SparkFun MOSFET Power Controller <https://www.sparkfun.com/products/11214>; PROD_ID: TRANS-11151
Q5 Q7 Q9 = SparkFun-DiscreteSemi:MOSFET_PCH: P-channel MOSFETs Voltage controlled devices that allow control of high current outputs. SparkFun Products: SparkFun ESP32 Thing <https://www.sparkfun.com/products/13907> SparkFun ESP8266 Thing <https://www.sparkfun.com/products/13231> SparkFun Pi Servo HAT V2 <https://www.sparkfun.com/products/15316> DMG2305UX-7 (20V/4.2A/SOT23-3); PROD_ID: TRAN-14388
Q6 Q8 Q10 = SparkFun-DiscreteSemi:TRANS_PNP_DUAL: Dual PNP Transistors in Single Package The BCM857BS puts two PNP transistors in a single package. Bipolar (BJT) Transistor Array 2 PNP (Dual) 45V 100mA 100MHz 200mW Surface Mount SOT-363 Datasheet <https://www.diodes.com/assets/Datasheets/BCM857BS.pdf> SparkFun Products: SparkFun Pi Servo HAT V2 <https://www.sparkfun.com>; PROD_ID: TRAN-14386
Q23 Q24 Q27 Q28 = SparkFun-DiscreteSemi:MOSFET-NCH: N-channel MOSFETs Voltage controlled devices that allow control of high current outputs. SparkFun Products: SparkFun OpenScale <https://www.sparkfun.com/products/13261> SparkFun Digital Sandbox <https://www.sparkfun.com/products/12651> SparkFun Monster Moto Shield <https://www.sparkfun.com/products/10182> SparkFun MOSFET Power Controller <https://www.sparkfun.com/products/11214>; PROD_ID: TRANS-14399
R1 R2 R4 R5 R8 R13 R15 R17-R19 R22 R33 R37-R44 = SparkFun-Resistors:10KOHM: 10kΩ resistor A resistor is a passive two-terminal electrical component that implements electrical resistance as a circuit element. Resistors act to reduce current flow, and, at the same time, act to lower voltage levels within circuits. - Wikipedia; PROD_ID: RES-00824
R3 R6 R10-R12 = SparkFun-Resistors:5.1KOHM; PROD_ID: RES-12083
R7 R9 R14 = SparkFun-Resistors:47KOHM: 47kΩ resistor A resistor is a passive two-terminal electrical component that implements electrical resistance as a circuit element. Resistors act to reduce current flow, and, at the same time, act to lower voltage levels within circuits. - Wikipedia; PROD_ID: RES-07871
R16 R45 R47 R53-R56 = SparkFun-Resistors:2.2KOHM: 2.2kΩ resistor A resistor is a passive two-terminal electrical component that implements electrical resistance as a circuit element. Resistors act to reduce current flow, and, at the same time, act to lower voltage levels within circuits. - Wikipedia; PROD_ID: RES-14341
R25 R26 = SparkFun-Resistors:1OHM: 1Ω resistor A resistor is a passive two-terminal electrical component that implements electrical resistance as a circuit element. Resistors act to reduce current flow, and, at the same time, act to lower voltage levels within circuits. - Wikipedia; PROD_ID: RES-08269
R27 = SparkFun-Resistors:470OHM: 470Ω resistor A resistor is a passive two-terminal electrical component that implements electrical resistance as a circuit element. Resistors act to reduce current flow, and, at the same time, act to lower voltage levels within circuits. - Wikipedia; PROD_ID: RES-07869
TP0 TP1-TP19 = SparkFun-Connectors:TEST-POINT: SparkFun Test Points Bare copper test points for troubleshooting or In-Circuit-Testing. These are used by our Production team for verifying production board runs using pogo-pins on test beds. SparkFun Products: SparkFun LSM9DS1 Breakout <https://www.sparkfun.com/products/13284> SparkFun PSOC <https://www.sparkfun.com/products/13714> SparkFun Load Cell Amplifier <https://www.sparkfun.com/products/13879>
U1 = SparkFun-IC-Special-Function:PCA9685: 16-channel 12-bit PWM I2C interface Internal Oscillator 40Hz to 1kHz Can be totem pole or open collector 2.3V to 5.5V SparkFun Products SparkFun Block for Intel® Edison - PWM <https://www.sparkfun.com/products/13042> (DEV-13042) PROTO: IC-12240 PROD_ID: IC-12271; PROD_ID: IC-12271
U4 = SparkFun-IC-Microcontroller:ATTINY84-ARDUINO; PROD_ID: IC-14155
U5 = SparkFun-IC-Special-Function:DRV883X: DRV8835 2 Channel Motor Driver Dual 1.5A H-bridge, 2-11V Datasheet <http://www.ti.com/lit/ds/symlink/drv8835.pdf> SparkFun Products: SparkFun Serial Controlled Motor Driver <https://www.sparkfun.com/products/13911>; PROD_ID: IC-13342
U6 = SparkFun-IC-Microcontroller:PSOC4_4200_40QFN: Cypress PSoC 4200 32-bit MCU 48-MHz ARM Cortex-M0 Datasheet <http://www.cypress.com/file/138656/download> SparkFun Products: SparkFun serial Controlled Motor Driver <https://www.sparkfun.com/products/13911>; PROD_ID: IC-13292
U7 = SparkFun-Sensors:ICM-20948: ICM-20948 9 Degree of Freedom IMU World’s lowest power 9-axis MotionTracking device that is ideally suited for smartphones, tablets, wearable sensors, and IoT applications. Includes onboard Digital Motion Processor to offload computations from the host processor Datasheet <https://cdn.sparkfun.com/assets/learn_tutorials/5/5/0/MPU9250REV1.0.pdf> SparkFun Products: SparkFun IMU Breakout - ICM-20948 <https://www.sparkfun.com/products/15182>; PROD_ID: IC-14247
U8 = SparkFun-IC-Power:V_REG_SP6214: Voltage Regulator - SP6214 SP6214 Series SC-70-5 Micropower SC-70 100 mA CMOS LDO Regulator Datasheet <https://www.exar.com/content/document.ashx?id=654> SparkFun Products: MP3 Trigger <https://www.sparkfun.com/products/13720> SparkFun Particle Sensor Breakout <https://www.sparkfun.com/products/14045>; PROD_ID: VREG-08428
U$1 = SparkFun-Aesthetics:QWIIC_LOGO: Qwiic Logos for placement on schematic and PCB. The 5.5mm silk logo is best for placing next to Qwiic connector.

## Net classes
1 power: width 0.508 mm